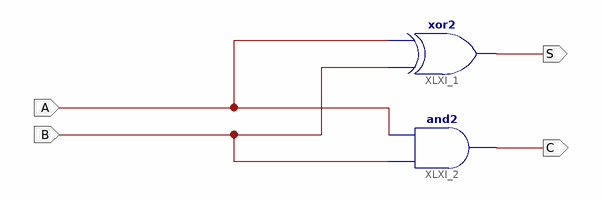
[diagram p0: schematic sheet 1]
// Xilinx ISE schematic half_adder.sch (artix7) as structural Verilog: 2 symbols, 4 ports
module half_adder (
  input  A,
  input  B,
  output S,
  output C
);

  xor XLXI_1 (S, B, A);
  and XLXI_2 (C, B, A);
endmodule
